# Altium schematic sheet 1114(1).schdoc
size 309 x 223 mm; Symbol: Sheet-Symbol_A4; Device: Sheet-Symbol_A4; @Page Name: P1; @Create Date: 2023-11-05; @Page Count: 1; @Page No: 1; @Project Name: 1; @Schematic Name: Schematic1; @Update Date: 2023-11-05; Company: 嘉立创EDA; Page Size: A4; Version: V1.0
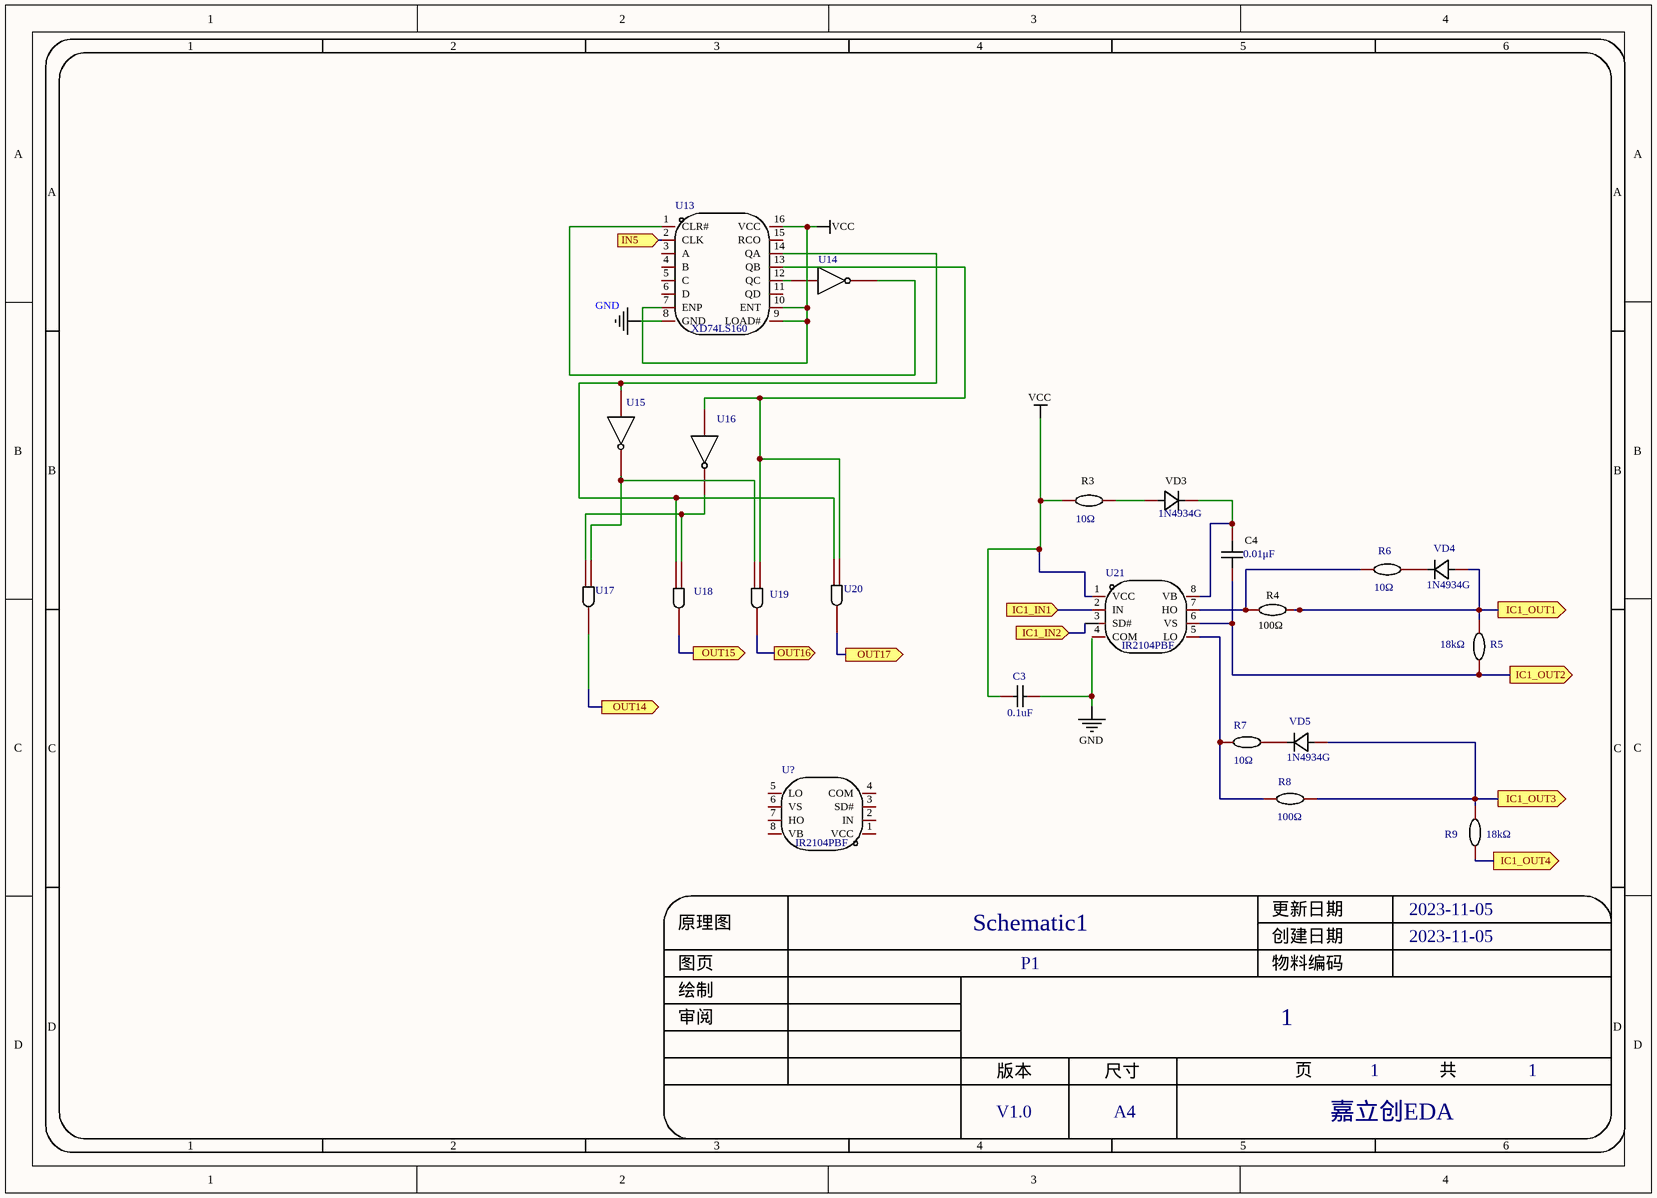
[diagram p0: 1114(1).schdoc]

## Parts
(Parts that share a designator on the sheet are numbered #1, #2 ... from top to bottom, then left to right.)
C3  value 0.1uF  (hidden comment: Capacitor)
C24  100nF  [C0603]  (value not drawn)
R17  Name: 10Ω  [R0603]  (hidden comment: 100K)
R18  10K  [R0603]  (value not drawn)
R?#1  Name: 10Ω  [R0603]  (hidden comment: 100K)
R?#2  10K  [R0603]  (value not drawn)
R?#3  Name: 10Ω  [R0603]  (hidden comment: 100K)
R?#4  Name: 100Ω  [R0603]  (hidden comment: 100K)
R?#5  Name: 18kΩ  [R0603]  (hidden comment: 100K)
U13  XD74LS160  [DIP-16_L19.8-W6.5-P2.54-LS7.6-BL]
U14  反相器  (value not drawn)
U15  反相器  (value not drawn)
U16  反相器  (value not drawn)
U17  与门  (value not drawn)
U18  与门  (value not drawn)
U19  与门  (value not drawn)
U20#1  1N4934G  [SMA_L4.3-W2.6-LS5.1-RD]
U20#2  与门  (value not drawn)
U21  IR2104PBF  [DIP-8_L9.9-W6.6-P2.54-LS7.62-BL]
U?#1  1N4934G  [SMA_L4.3-W2.6-LS5.1-RD]
U?#2  1N4934G  [SMA_L4.3-W2.6-LS5.1-RD]
U?#3  IR2104PBF  [DIP-8_L9.9-W6.6-P2.54-LS7.62-BL]

## Ports
IC1_IN1 (in), IC1_IN2 (in), IC1_OUT1 (out), IC1_OUT2 (out), IC1_OUT3 (out), IC1_OUT4 (out), IN5 (in), OUT14 (out), OUT15 (out), OUT16 (out), OUT17 (out)

## Nets
GND: C3.2
VCC: C3.1 R17.1 U13.7(ENP) U13.9(LOAD#) U13.10(ENT) U13.16(VCC) U21.1(VCC)
IC1_IN1: U21.2(IN) ; port IC1_IN1
IC1_OUT1: R18.2 R?#2.2 U?#1.2(A) ; port IC1_OUT1
IC1_OUT2: C24.1 R?#2.1 U21.6(VS) ; port IC1_OUT2
IC1_OUT3: R?#4.2 R?#5.2 U?#2.2(A) ; port IC1_OUT3
IC1_OUT4: R?#5.1 ; port IC1_OUT4
IN5: U13.2(CLK) ; port IN5
OUT14: U17.2 ; port OUT14
OUT15: U18.2 ; port OUT15
OUT16: U19.2 ; port OUT16
OUT17: U20#2.2 ; port OUT17
NetC24_2: C24.2 U20#1.1(K) U21.8(VB)
NetR17_2: R17.2 U20#1.2(A)
NetR18_1: R18.1 R?#1.1 U21.7(HO)
NetR?#1_2: R?#1.2 U?#1.1(K)
NetR?#3_1: R?#3.1 R?#4.1 U21.5(LO)
NetR?#3_2: R?#3.2 U?#2.1(K)
NetU13_1: U13.1(CLR#) U14.2
NetU13_12: U13.12(QC) U14.1
NetU13_13: U13.13(QB) U16.1 U19.3 U20#2.3
NetU13_14: U13.14(QA) U15.1 U18.1 U20#2.1
NetU15_2: U15.2 U17.3 U19.1
NetU16_2: U16.2 U17.1 U18.3

Not connected (* = marked no-connect by the designer): U13 3(A) 4(B) 5(C) 6(D) 8(GND) 11(QD) 15(RCO); U21 3(SD#) 4(COM); U?#3 1(VCC) 2(IN) 3(SD#) 4(COM) 5(LO) 6(VS) 7(HO) 8(VB)

## Notes on the sheet
- (near R17) R3
- (near U20#1) VD3
- (near C24) C4
- (near C24) 0.01μF
- (near R18) R4
- (near R?#1) R6
- (near U?#1) VD4
- (near R18) 100Ω
- (near R?#2) 18kΩ
- (near R?#2) R5
- (near R?#3) R7
- (near U?#2) VD5
- (near R?#4) R8
- (near R?#5) R9
- Labels drawn without touching a wire or pin: GND
- 1
- 2
- 3
- 4
- 5
- 6
- A
- B
- C
- 原理图
- Schematic1
- 创建日期
- 更新日期
- 2023-11-05
- 审阅
- 绘制
- 图页
- P1
- 物料编码
- D
- 版本
- 尺寸
- 页
- 共
- V1.0
- A4
- 嘉立创EDA

## Library data of the parts
C3 = Capacitor: SimulationGenericComponent: True; Add into BOM: yes; Name: Capacitor; Symbol: Capacitor; Device: Capacitor; Convert to PCB: yes; Origin Footprint: Capacitor; Design Item ID: Capacitor; Library Name: Simulation Generic Components
C24 = CAP_0603: Symbol: CapAcitance; Convert to PCB: yes; Name: 100nF; Device: CAP_0603; Add into BOM: yes; Supplier Footprint: 0603; Value: 100nF
R17 R18 R?#1-R?#5 = Res_0603: Symbol: 电阻; Convert to PCB: yes; Device: Res_0603; Add into BOM: yes; Supplier Footprint: 0603
  R17 R?#1 R?#3-R?#5: Value: 100K
  R18 R?#2: Name: 10K; Value: 10K
U13 = XD74LS160: 逻辑电路 计数器/分频器; Manufacturer: XINLUDA(信路达); Add into BOM: yes; Name: XD74LS160; Symbol: XD74LS160; Device: XD74LS160; LCSC Part Name: 计数器 IC; Supplier Part: C968687; Manufacturer Part: XD74LS160; Supplier Footprint: DIP-16; JLCPCB Part Class: 扩展库; Supplier: LCSC; Convert to PCB: yes
U14-U16 = 反相器: Add into BOM: yes; Symbol: 反相器; Device: 反相器; Convert to PCB: yes
U17-U19 U20#2 = 与门: Add into BOM: yes; Symbol: 与门; Device: 与门; Convert to PCB: yes
U20#1 U?#1 U?#2 = 1N4007: Symbol: 1N4007_C9900004759; Add into BOM: yes; Name: 1N4934G; Device: 1N4007; LCSC Part Name: 1N4007; Supplier Part: C9900004759; Manufacturer Part: 1N4934G; Supplier Footprint: SMA_L4.3-W2.6-LS5.1-RD; JLCPCB Part Class: Extended Part; Supplier: LCSC; Convert to PCB: yes
U21 U?#3 = IR2104PBF: 驱动配置:半桥;负载类型:MOSFET；IGBT;电源电压:10V~20V;峰值灌电流:360mA;峰值拉电流:210mA;; Manufacturer: Infineon(英飞凌); Add into BOM: yes; Driven Configuration: 半桥; Number of Drivers: 2; Peak Output Current(sink): 360mA; Peak Output Current(source): 210mA; Rise Time: 100ns; Fall Time: 50ns; Name: IR2104PBF; Symbol: IR2104PBF; Device: IR2104PBF; LCSC Part Name: IR2104PBF; Supplier Part: C2959; Manufacturer Part: IR2104PBF; Supplier Footprint: DIP-8; JLCPCB Part Class: 扩展库; Datasheet: https://atta.szlcsc.com/upload/public/pdf/source/20140906/1457707236579.pdf; Supplier: LCSC; Convert to PCB: yes; Load Type: MOSFET；IGBT; Supply Voltage: 10V~20V; Operating Temperature: -40℃~+150℃@(Tj)